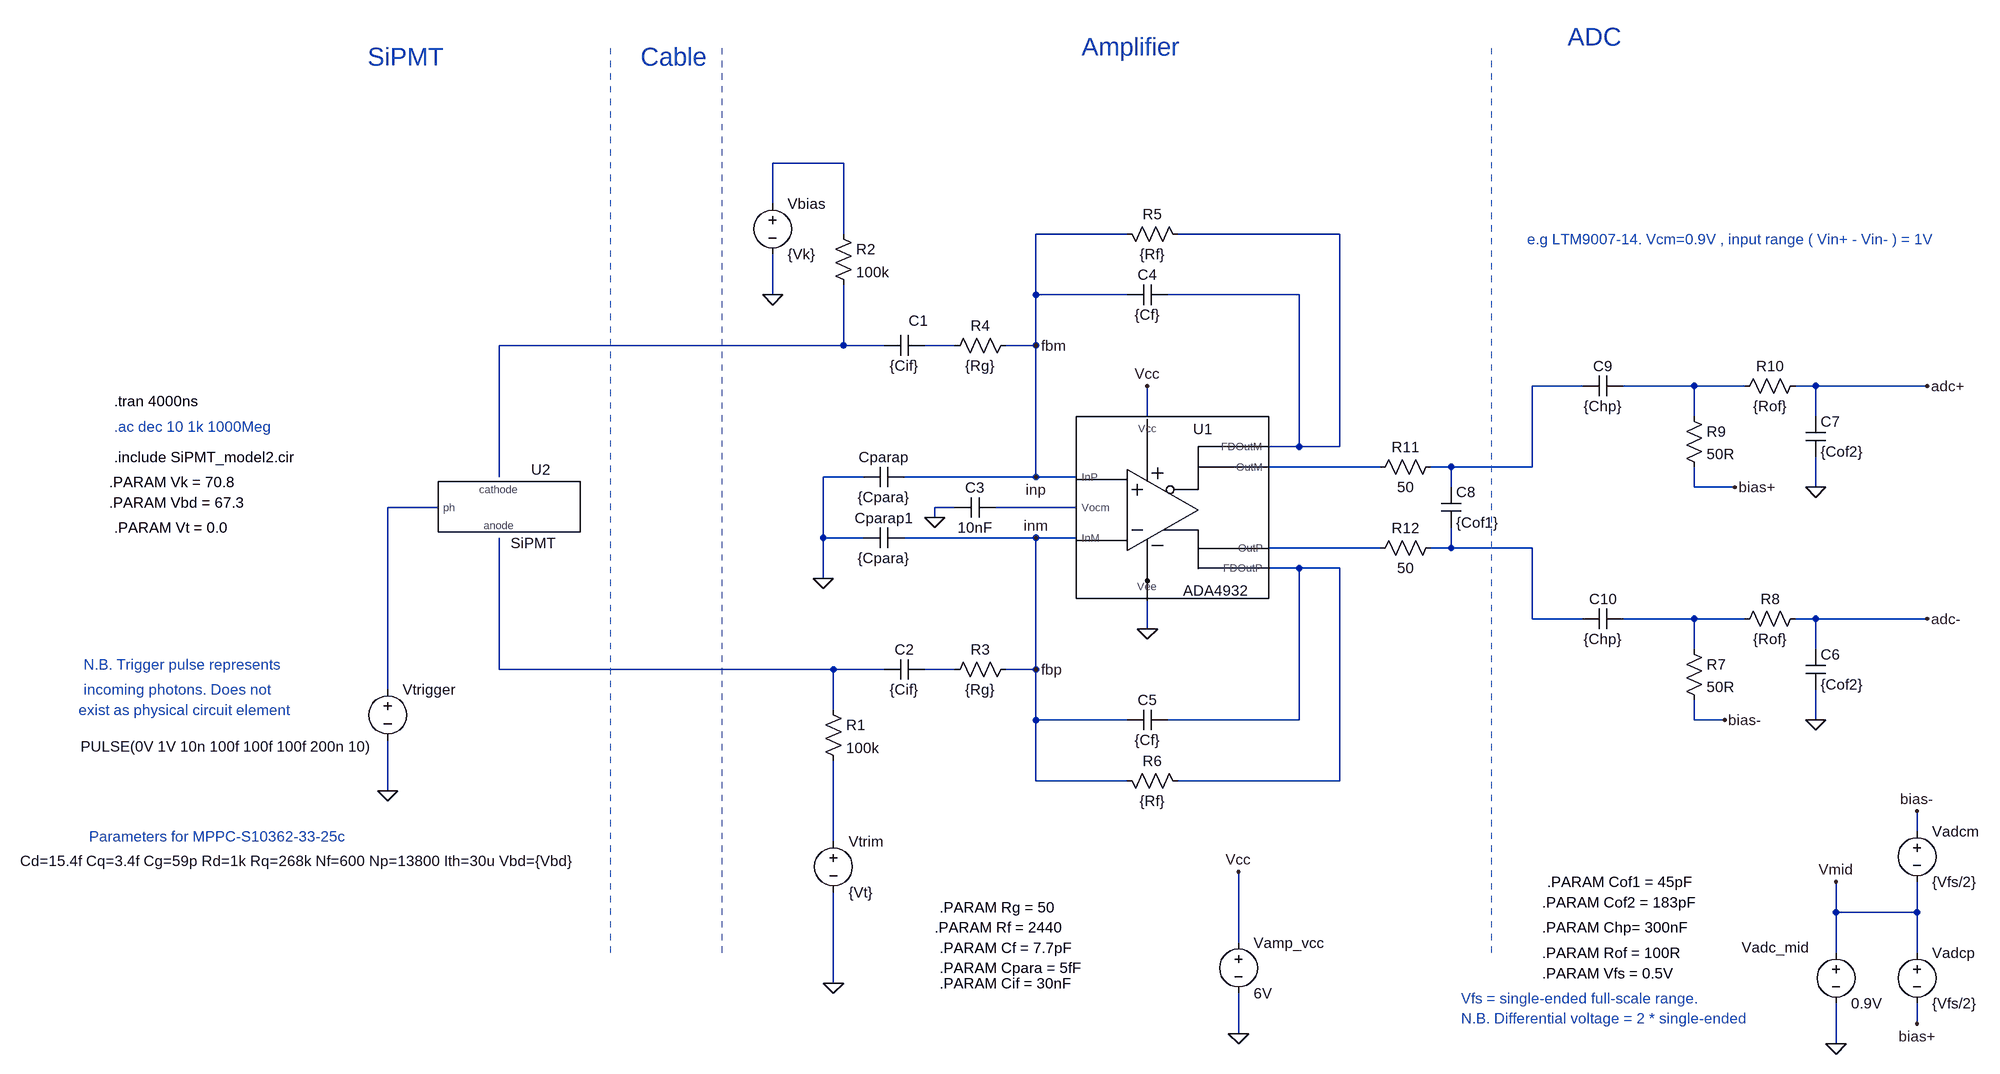
[diagram p0: schematic SiPMT_test_mppc33_ada4932_v8_unipolar_multipulse.asc]
SiPMT_test_mppc33_ada4932_v8_unipolar_multipulse.asc, the LTspice schematic file:
Version 4
SHEET 1 3296 1892
WIRE 1456 64 1344 64
WIRE 1344 128 1344 64
WIRE 1456 176 1456 64
WIRE 1904 176 1760 176
WIRE 2240 176 1984 176
WIRE 1344 272 1344 208
WIRE 1760 272 1760 176
WIRE 1904 272 1760 272
WIRE 2176 272 1968 272
WIRE 1456 352 1456 256
WIRE 1456 352 912 352
WIRE 1520 352 1456 352
WIRE 1632 352 1584 352
WIRE 1760 352 1760 272
WIRE 1760 352 1712 352
WIRE 2624 416 2544 416
WIRE 2800 416 2688 416
WIRE 2880 416 2800 416
WIRE 2992 416 2960 416
WIRE 3168 416 2992 416
WIRE 1936 464 1936 416
WIRE 2800 464 2800 416
WIRE 2992 464 2992 416
WIRE 2176 512 2176 272
WIRE 2176 512 2128 512
WIRE 2240 512 2240 176
WIRE 2240 512 2176 512
WIRE 2304 544 2128 544
WIRE 2416 544 2384 544
WIRE 2544 544 2544 416
WIRE 2544 544 2416 544
WIRE 912 560 912 352
WIRE 1488 560 1424 560
WIRE 1760 560 1760 352
WIRE 1760 560 1552 560
WIRE 1824 560 1760 560
WIRE 2416 576 2416 544
WIRE 2800 576 2800 544
WIRE 2864 576 2800 576
WIRE 2992 576 2992 528
WIRE 816 608 736 608
WIRE 1632 608 1600 608
WIRE 1824 608 1696 608
WIRE 1600 624 1600 608
WIRE 1424 656 1424 560
WIRE 1488 656 1424 656
WIRE 1760 656 1552 656
WIRE 1824 656 1760 656
WIRE 2304 672 2128 672
WIRE 2416 672 2416 640
WIRE 2416 672 2384 672
WIRE 2544 672 2416 672
WIRE 2176 704 2128 704
WIRE 2240 704 2176 704
WIRE 1424 720 1424 656
WIRE 2544 784 2544 672
WIRE 2624 784 2544 784
WIRE 2800 784 2688 784
WIRE 2880 784 2800 784
WIRE 2992 784 2960 784
WIRE 3168 784 2992 784
WIRE 1936 800 1936 752
WIRE 2800 832 2800 784
WIRE 2992 832 2992 784
WIRE 912 864 912 656
WIRE 1440 864 912 864
WIRE 1520 864 1440 864
WIRE 1632 864 1584 864
WIRE 1760 864 1760 656
WIRE 1760 864 1712 864
WIRE 736 896 736 608
WIRE 1440 928 1440 864
WIRE 1760 944 1760 864
WIRE 1904 944 1760 944
WIRE 2176 944 2176 704
WIRE 2176 944 1968 944
WIRE 2800 944 2800 912
WIRE 2848 944 2800 944
WIRE 2992 944 2992 896
WIRE 1760 1040 1760 944
WIRE 1904 1040 1760 1040
WIRE 2240 1040 2240 704
WIRE 2240 1040 1984 1040
WIRE 736 1056 736 976
WIRE 3152 1120 3152 1088
WIRE 1440 1136 1440 1008
WIRE 3024 1248 3024 1200
WIRE 3152 1248 3152 1200
WIRE 3152 1248 3024 1248
WIRE 2080 1296 2080 1184
WIRE 3024 1312 3024 1248
WIRE 3152 1312 3152 1248
WIRE 1440 1360 1440 1216
WIRE 3152 1424 3152 1392
WIRE 2080 1440 2080 1376
WIRE 3024 1456 3024 1392
FLAG 1344 272 0
FLAG 1440 1360 0
FLAG 736 1056 0
FLAG 1936 416 Vcc
FLAG 1936 800 0
FLAG 2080 1440 0
FLAG 2080 1184 Vcc
FLAG 1600 624 0
FLAG 3168 784 adc-
FLAG 3168 416 adc+
FLAG 3024 1456 0
FLAG 3024 1200 Vmid
FLAG 3152 1088 bias-
FLAG 3152 1424 bias+
FLAG 2864 576 bias+
FLAG 2848 944 bias-
FLAG 2992 576 0
FLAG 2992 944 0
FLAG 1760 352 fbm
FLAG 1760 560 inp
FLAG 1760 656 inm
FLAG 1760 864 fbp
FLAG 1424 720 0
SYMBOL voltage 1344 112 R0
SYMATTR InstName Vbias
SYMATTR Value {Vk}
SYMBOL res 1424 912 R0
SYMATTR InstName R1
SYMATTR Value 100k
SYMBOL voltage 736 880 R0
WINDOW 3 -485 106 Left 2
WINDOW 123 0 0 Left 2
WINDOW 39 0 0 Left 2
SYMATTR Value PULSE(0V 1V 10n 100f 100f 100f 200n 10)
SYMATTR InstName Vtrigger
SYMBOL res 1440 160 R0
SYMATTR InstName R2
SYMATTR Value 100k
SYMBOL cap 1520 336 M90
WINDOW 0 -8 54 VBottom 2
WINDOW 3 32 32 VTop 2
SYMATTR InstName C1
SYMATTR Value {Cif}
SYMBOL cap 1520 848 M90
WINDOW 0 0 32 VBottom 2
WINDOW 3 32 32 VTop 2
SYMATTR InstName C2
SYMATTR Value {Cif}
SYMBOL res 1728 336 R90
WINDOW 0 0 56 VBottom 2
WINDOW 3 32 56 VTop 2
SYMATTR InstName R4
SYMATTR Value {Rg}
SYMBOL res 1728 848 R90
WINDOW 0 0 56 VBottom 2
WINDOW 3 32 56 VTop 2
SYMATTR InstName R3
SYMATTR Value {Rg}
SYMBOL voltage 2080 1280 R0
WINDOW 123 0 0 Left 2
WINDOW 39 0 0 Left 2
SYMATTR InstName Vamp_vcc
SYMATTR Value 6V
SYMBOL cap 1696 592 R90
WINDOW 0 0 32 VBottom 2
WINDOW 3 32 32 VTop 2
SYMATTR InstName C3
SYMATTR Value 10nF
SYMBOL res 1888 160 M90
WINDOW 0 0 56 VBottom 2
WINDOW 3 32 56 VTop 2
SYMATTR InstName R5
SYMATTR Value {Rf}
SYMBOL cap 1968 256 R90
WINDOW 0 0 32 VBottom 2
WINDOW 3 32 32 VTop 2
SYMATTR InstName C4
SYMATTR Value {Cf}
SYMBOL res 1888 1024 M90
WINDOW 0 0 56 VBottom 2
WINDOW 3 32 56 VTop 2
SYMATTR InstName R6
SYMATTR Value {Rf}
SYMBOL cap 1968 928 R90
WINDOW 0 0 32 VBottom 2
WINDOW 3 32 32 VTop 2
SYMATTR InstName C5
SYMATTR Value {Cf}
SYMBOL cap 2688 400 R90
WINDOW 0 0 32 VBottom 2
WINDOW 3 32 32 VTop 2
SYMATTR InstName C9
SYMATTR Value {Chp}
SYMBOL cap 2688 768 R90
WINDOW 0 0 32 VBottom 2
WINDOW 3 32 32 VTop 2
SYMATTR InstName C10
SYMATTR Value {Chp}
SYMBOL res 2784 816 R0
SYMATTR InstName R7
SYMATTR Value 50R
SYMBOL res 2976 768 R90
WINDOW 0 0 56 VBottom 2
WINDOW 3 32 56 VTop 2
SYMATTR InstName R8
SYMATTR Value {Rof}
SYMBOL cap 2976 832 R0
SYMATTR InstName C6
SYMATTR Value {Cof2}
SYMBOL res 2784 448 R0
SYMATTR InstName R9
SYMATTR Value 50R
SYMBOL res 2976 400 R90
WINDOW 0 0 56 VBottom 2
WINDOW 3 32 56 VTop 2
SYMATTR InstName R10
SYMATTR Value {Rof}
SYMBOL cap 2976 464 R0
SYMATTR InstName C7
SYMATTR Value {Cof2}
SYMBOL voltage 3152 1104 R0
WINDOW 123 0 0 Left 2
WINDOW 39 0 0 Left 2
SYMATTR InstName Vadcm
SYMATTR Value {Vfs/2}
SYMBOL voltage 3152 1296 R0
WINDOW 123 0 0 Left 2
WINDOW 39 0 0 Left 2
SYMATTR InstName Vadcp
SYMATTR Value {Vfs/2}
SYMBOL voltage 3024 1296 R0
WINDOW 123 0 0 Left 2
WINDOW 39 0 0 Left 2
WINDOW 0 -149 7 Left 2
SYMATTR InstName Vadc_mid
SYMATTR Value 0.9V
SYMBOL voltage 1440 1120 R0
SYMATTR InstName Vtrim
SYMATTR Value {Vt}
SYMBOL SiPMT 912 608 R0
WINDOW 39 -316 543 Top 2
SYMATTR SpiceLine Cd=15.4f Cq=3.4f Cg=59p Rd=1k Rq=268k Nf=600 Np=13800 Ith=30u Vbd={Vbd}
SYMATTR InstName U2
SYMBOL cap 1552 544 R90
WINDOW 0 0 32 VBottom 2
WINDOW 3 32 32 VTop 2
SYMATTR InstName Cparap
SYMATTR Value {Cpara}
SYMBOL cap 1552 640 R90
WINDOW 0 0 32 VBottom 2
WINDOW 3 32 32 VTop 2
SYMATTR InstName Cparap1
SYMATTR Value {Cpara}
SYMBOL res 2400 528 R90
WINDOW 0 0 56 VBottom 2
WINDOW 3 32 56 VTop 2
SYMATTR InstName R11
SYMATTR Value 50
SYMBOL res 2400 656 R90
WINDOW 0 0 56 VBottom 2
WINDOW 3 32 56 VTop 2
SYMATTR InstName R12
SYMATTR Value 50
SYMBOL cap 2400 576 R0
SYMATTR InstName C8
SYMATTR Value {Cof1}
SYMBOL ADA4932 1952 608 R0
SYMATTR InstName U1
TEXT 304 480 Left 2 ;.ac dec 10 1k 1000Meg
TEXT 304 528 Left 2 !.include SiPMT_model2.cir
TEXT 296 568 Left 2 !.PARAM Vk = 70.8
TEXT 296 600 Left 2 !.PARAM Vbd = 67.3
TEXT 264 1128 Left 2 ;Parameters for MPPC-S10362-33-25c
TEXT 1608 1240 Left 2 !.PARAM Rg = 50
TEXT 1600 1272 Left 2 !.PARAM Rf = 2440
TEXT 1608 1304 Left 2 !.PARAM Cf = 7.7pF
TEXT 2560 1232 Left 2 !.PARAM Cof2 = 183pF
TEXT 2560 1272 Left 2 !.PARAM Chp= 300nF
TEXT 2560 1312 Left 2 !.PARAM Rof = 100R
TEXT 1832 -120 Left 4 ;Amplifier
TEXT 2600 -136 Left 4 ;ADC
TEXT 704 -104 Left 4 ;SiPMT
TEXT 256 856 Left 2 ;N.B. Trigger pulse represents
TEXT 256 896 Left 2 ;incoming photons. Does not
TEXT 248 928 Left 2 ;exist as physical circuit element
TEXT 2536 184 Left 2 ;e.g LTM9007-14. Vcm=0.9V , input range ( Vin+ - Vin- ) = 1V
TEXT 304 640 Left 2 !.PARAM Vt = 0.0
TEXT 1136 -104 Left 4 ;Cable
TEXT 1608 1336 Left 2 !.PARAM Cpara = 5fF
TEXT 304 440 Left 2 !.tran 4000ns
TEXT 1608 1360 Left 2 !.PARAM Cif = 30nF
TEXT 2560 1344 Left 2 !.PARAM Vfs = 0.5V
TEXT 2432 1384 Left 2 ;Vfs = single-ended full-scale range. \nN.B. Differential voltage = 2 * single-ended
TEXT 2568 1200 Left 2 !.PARAM Cof1 = 45pF
LINE Normal 2480 1312 2480 -128 2
LINE Normal 1264 1312 1264 -128 2
LINE Normal 1088 1312 1088 -128 2

The netlist it stands for:
* SiPMT_test_mppc33_ada4932_v8_unipolar_multipulse.asc
Vbias N001 0 {Vk}
R1 N014 N016 100k
Vtrigger N008 0 PULSE(0V 1V 10n 100f 100f 100f 200n 10)
R2 N001 N003 100k
C1 N003 N004 {Cif}
C2 N014 N015 {Cif}
R4 inp N004 {Rg}
R3 fbp N015 {Rg}
Vamp_vcc Vcc 0 6V
C3 N009 0 10nF
R5 inp N002 {Rf}
C4 N002 inp {Cf}
R6 fbp N012 {Rf}
C5 N012 fbp {Cf}
C9 N006 N005 {Chp}
C10 N013 N011 {Chp}
R7 N013 bias- 50R
R8 adc- N013 {Rof}
C6 adc- 0 {Cof2}
R9 N006 bias+ 50R
R10 adc+ N006 {Rof}
C7 adc+ 0 {Cof2}
Vadcm bias- Vmid {Vfs/2}
Vadcp Vmid bias+ {Vfs/2}
Vadc_mid Vmid 0 0.9V
Vtrim N016 0 {Vt}
XU2 N014 N003 N008 SiPMT Cd=15.4f Cq=3.4f Cg=59p Rd=1k Rq=268k Nf=600 Np=13800 Ith=30u Vbd={Vbd}  ; pins anode cathode ph
Cparap inp 0 {Cpara}
Cparap1 fbp 0 {Cpara}
R11 N005 N007 50
R12 N011 N010 50
C8 N005 N011 {Cof1}
XU1 N002 N012 inp fbp Vcc 0 N010 N007 N009 ADA4932  ; pins FDOutM FDOutP InP InM Vcc Vee OutP OutM Vocm
* .ac dec 10 1k 1000Meg
.include SiPMT_model2.cir
.PARAM Vk = 70.8
.PARAM Vbd = 67.3
* Parameters for MPPC-S10362-33-25c
.PARAM Rg = 50
.PARAM Rf = 2440
.PARAM Cf = 7.7pF
.PARAM Cof2 = 183pF
.PARAM Chp= 300nF
.PARAM Rof = 100R
* Amplifier
* ADC
* SiPMT
* N.B. Trigger pulse represents
* incoming photons. Does not
* exist as physical circuit element
* e.g LTM9007-14. Vcm=0.9V , input range ( Vin+ - Vin- ) = 1V
.PARAM Vt = 0.0
* Cable
.PARAM Cpara = 5fF
.tran 4000ns
.PARAM Cif = 30nF
.PARAM Vfs = 0.5V
* Vfs = single-ended full-scale range.
* N.B. Differential voltage = 2 * single-ended
.PARAM Cof1 = 45pF
.lib SiPMT_model2.cir
.lib ./ada4932.cir
.backanno
.end